# Altium schematic sheet GEC.SchDoc
size A4; SheetNumber: 1; SheetTotal: 5
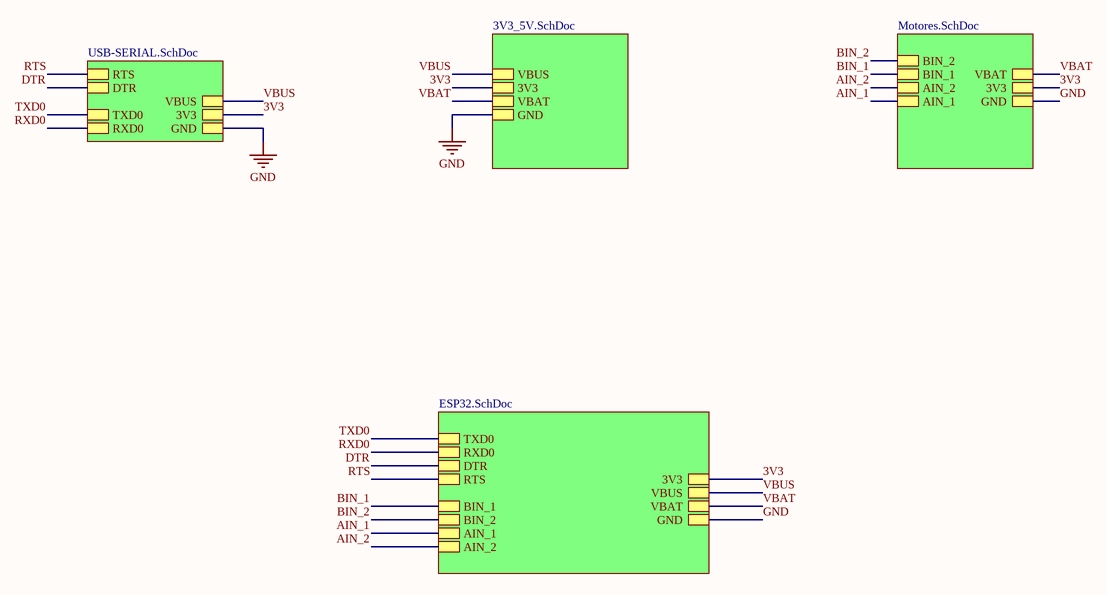
[diagram p0: GEC.SchDoc]

## Sub-sheets
Designator = USB-SERIAL.SchDoc: RTS, GND, 3V3, DTR, VBUS, TXD0, RXD0
Designator = 3V3_5V.SchDoc: VBUS, 3V3, VBAT, GND
Designator = Motores.SchDoc: BIN_2, GND, 3V3, BIN_1, AIN_2, AIN_1, VBAT
Designator = ESP32.SchDoc: 3V3, VBUS, BIN_1, GND, BIN_2, TXD0, VBAT, RXD0, DTR, AIN_2, AIN_1, RTS

## Nets
GND: sheet Designator/GND, sheet Designator/GND, sheet Designator/GND, sheet Designator/GND
3V3: sheet Designator/3V3, sheet Designator/3V3, sheet Designator/3V3, sheet Designator/3V3
AIN_1: sheet Designator/AIN_1, sheet Designator/AIN_1
AIN_2: sheet Designator/AIN_2, sheet Designator/AIN_2
BIN_1: sheet Designator/BIN_1, sheet Designator/BIN_1
BIN_2: sheet Designator/BIN_2, sheet Designator/BIN_2
DTR: sheet Designator/DTR, sheet Designator/DTR
RTS: sheet Designator/RTS, sheet Designator/RTS
RXD0: sheet Designator/RXD0, sheet Designator/RXD0
TXD0: sheet Designator/TXD0, sheet Designator/TXD0
VBAT: sheet Designator/VBAT, sheet Designator/VBAT, sheet Designator/VBAT
VBUS: sheet Designator/VBUS, sheet Designator/VBUS, sheet Designator/VBUS